# Altium schematic sheet MB_DAC.SchDoc
size 420 x 297 mm; Date: 18/12/2022; ApprovedBy: UA3REO; CheckedBy: UA3REO; Author: RU4PN; CompanyName: Wolf Team; DocumentNumber: Wolf2 MainBoard DAC; SheetNumber: 5; SheetTotal: 7
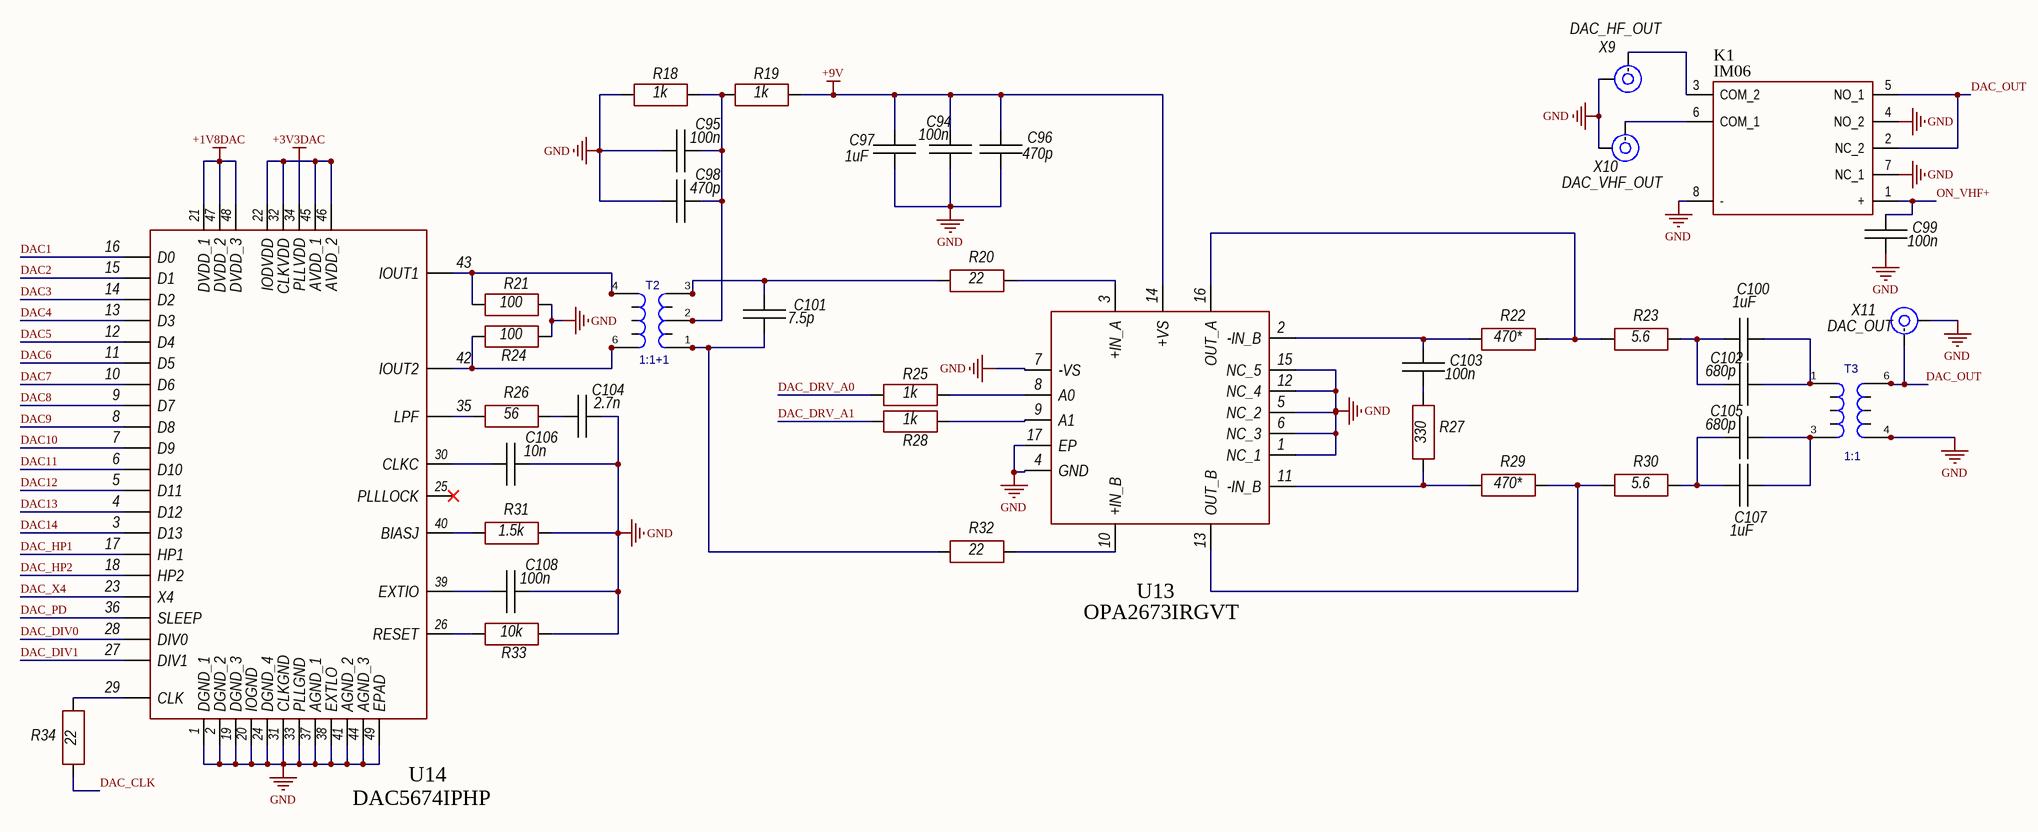
[diagram p0: MB_DAC.SchDoc]

## Parts
C94  100n  [CH0805C]
C95  100n  [CH0805C]
C96  470p  [CH0805C]
C97  1uF  [CH0805C]
C98  470p  [CH0805C]
C99  100n  [CH0805C]
C100  1uF  [CH0805C]
C101  7.5p  [CH0805C]
C102  680p  [CH0805C]
C103  100n  [CH0805C]
C104  2.7n  [CH0805C]
C105  680p  [CH0805C]
C106  10n  [CH0805C]
C107  1uF  [CH0805C]
C108  100n  [CH0805C]
K1  IM06  [IM06]
R18  1k  [CH0805R]
R19  1k  [CH0805R]
R20  22  [CH0805R]
R21  100  [CH0805R]
R22  470*  [CH0805R]
R23  5.6  [CH0805R]
R24  100  [CH0805R]
R25  1k  [CH0805R]
R26  56  [CH0805R]
R27  330  [CH0805R]
R28  1k  [CH0805R]
R29  470*  [CH0805R]
R30  5.6  [CH0805R]
R31  1.5k  [CH0805R]
R32  22  [CH0805R]
R33  10k  [CH0805R]
R34  22  [CH0805R]
T2  1:1+1  [TRANSF_ACORE2]
T3  1:1  [TRANSF_ACORE]
U13  OPA2673IRGVT  [16-QFN 4x4 PAD17]
U14  DAC5674IPHP  [48-TQFP]
X9  DAC_HF_OUT  [CON: SMA]
X10  DAC_VHF_OUT  [CON: SMA]
X11  DAC_OUT  [CON: SMA]

## Nets
+1V8DAC: U14.21(DVDD_1) U14.47(DVDD_2) U14.48(DVDD_3)
+3V3DAC: U14.22(IODVDD) U14.32(CLKVDD) U14.34(PLLVDD) U14.45(AVDD_1) U14.46(AVDD_2)
+9V: C94.2 C96.2 C97.2 R19.1 U13.14(+VS)
GND: C94.1 C95.1 C96.1 C97.1 C98.1 C99.1 C104.2 C106.2 C108.2 K1.4(NO_2) K1.7(NC_1) K1.8(-) R18.2 R21.1 R24.1 R31.1 R33.1 T3.4(S2) T3.11 U13.1(NC_1) U13.4(GND) U13.5(NC_2) U13.6(NC_3) U13.7(-VS) U13.12(NC_4) U13.15(NC_5) U13.17(EP) U14.1(DGND_1) U14.2(DGND_2) U14.19(DGND_3) U14.20(IOGND) U14.24(DGND_4) U14.31(CLKGND) U14.33(PLLGND) U14.37(AGND_1) U14.38(EXTLO) U14.41(AGND_2) U14.44(AGND_3) U14.49(EPAD) X9.2(IN) X10.2(IN) X11.2(IN)
DAC1: U14.16(D0)
DAC2: U14.15(D1)
DAC3: U14.14(D2)
DAC4: U14.13(D3)
DAC5: U14.12(D4)
DAC6: U14.11(D5)
DAC7: U14.10(D6)
DAC8: U14.9(D7)
DAC9: U14.8(D8)
DAC10: U14.7(D9)
DAC11: U14.6(D10)
DAC12: U14.5(D11)
DAC13: U14.4(D12)
DAC14: U14.3(D13)
DAC_CLK: R34.2
DAC_DIV0: U14.28(DIV0)
DAC_DIV1: U14.27(DIV1)
DAC_DRV_A0: R25.2
DAC_DRV_A1: R28.2
DAC_HP1: U14.17(HP1)
DAC_HP2: U14.18(HP2)
DAC_OUT: K1.2(NC_2) K1.5(NO_1) T3.6(S1) T3.10 X11.1(IN)
DAC_PD: U14.36(SLEEP)
DAC_X4: U14.23(X4)
ON_VHF+: C99.2 K1.1(+)
NetC95_2: C95.2 C98.2 R18.1 R19.2 T2.2(S2) T2.8
NetC100_1: C100.1 C102.1 T3.1(P1) T3.7
NetC100_2: C100.2 C102.2 R23.1
NetC101_1: C101.1 R20.2 T2.3(S1) T2.9
NetC101_2: C101.2 R32.2 T2.1(S3) T2.7
NetC103_1: C103.1 R27.1
NetC103_2: C103.2 R22.2 U13.2(-IN_B)
NetC104_1: C104.1 R26.1
NetC105_1: C105.1 C107.1 T3.3(P2) T3.9
NetC105_2: C105.2 C107.2 R30.1
NetC106_1: C106.1 U14.30(CLKC)
NetC108_1: C108.1 U14.39(EXTIO)
NetK1_3: K1.3(COM_2) X9.1(IN)
NetK1_6: K1.6(COM_1) X10.1(IN)
NetR20_1: R20.1 U13.3(+IN_A)
NetR21_2: R21.2 T2.4(P1) T2.11 U14.43(IOUT1)
NetR22_1: R22.1 R23.2 U13.16(OUT_A)
NetR24_2: R24.2 T2.6(P2) T2.10 U14.42(IOUT2)
NetR25_1: R25.1 U13.8(A0)
NetR26_2: R26.2 U14.35(LPF)
NetR27_2: R27.2 R29.2 U13.11(-IN_B)
NetR28_1: R28.1 U13.9(A1)
NetR29_1: R29.1 R30.2 U13.13(OUT_B)
NetR31_2: R31.2 U14.40(BIASJ)
NetR32_1: R32.1 U13.10(+IN_B)
NetR33_2: R33.2 U14.26(RESET)
NetR34_1: R34.1 U14.29(CLK)

Not connected (* = marked no-connect by the designer): T3 8(0); U14 25(PLLLOCK)*

## Notes on the sheet
- Перв. примен.
- Справ. №
- Подп. и дата
- Инв. № дубл.
- Взам. инв. №
- Разраб.
- Изм.
- Лист
- № докум.
- Подп.
- Дата
- Лит.
- Масса
- Масштаб
- Пров.
- Т.контр.
- Листов
- Инв. № подл.
- Утв.
- Н.контр.
- 2.106-A3
- Копировал
- Формат А3

## Library data of the parts
C94-C108 = Capacitor: Manufacturer: *; Model: *; HelpURL: *; ComponentKind: *; Value: *
K1 = IM06-V1
R18-R34 = Resistor: Manufacturer: *; Model: *; HelpURL: *; ComponentKind: *; Value: *
T2 = TRANSF_ACORE2: Transformer; Value: 1:1+1
T3 = TRANSF_ACORE: Transformer; Value: 1:1
X9-X11 = SMA: RF; Model: *; Manufacturer: *; HelpURL: *; ComponentKind: *